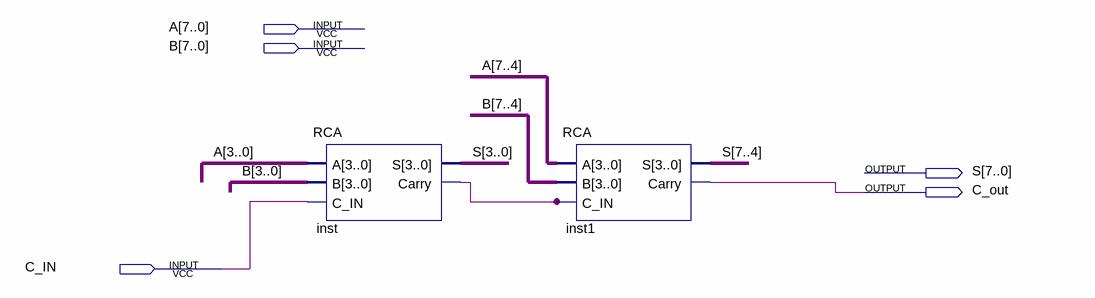
[diagram p0: schematic sheet]
// Quartus schematic RCA8.bdf as structural Verilog: 2 symbols, 5 pins
module RCA8 (
  input  [7:0] A,
  input  [7:0] B,
  input  C_IN,
  output [7:0] S,
  output C_out
);

  wire inst_carry;

  RCA inst (.A(A[3:0]), .B(B[3:0]), .C_IN(C_IN), .S(S[3:0]), .Carry(inst_carry));
  RCA inst1 (.A(A[7:4]), .B(B[7:4]), .C_IN(inst_carry), .S(S[7:4]), .Carry(C_out));
endmodule
